# EAGLE design LCD_BiasSupply_Segunda (EAGLE 5.11)

## Sheet 1 of 2
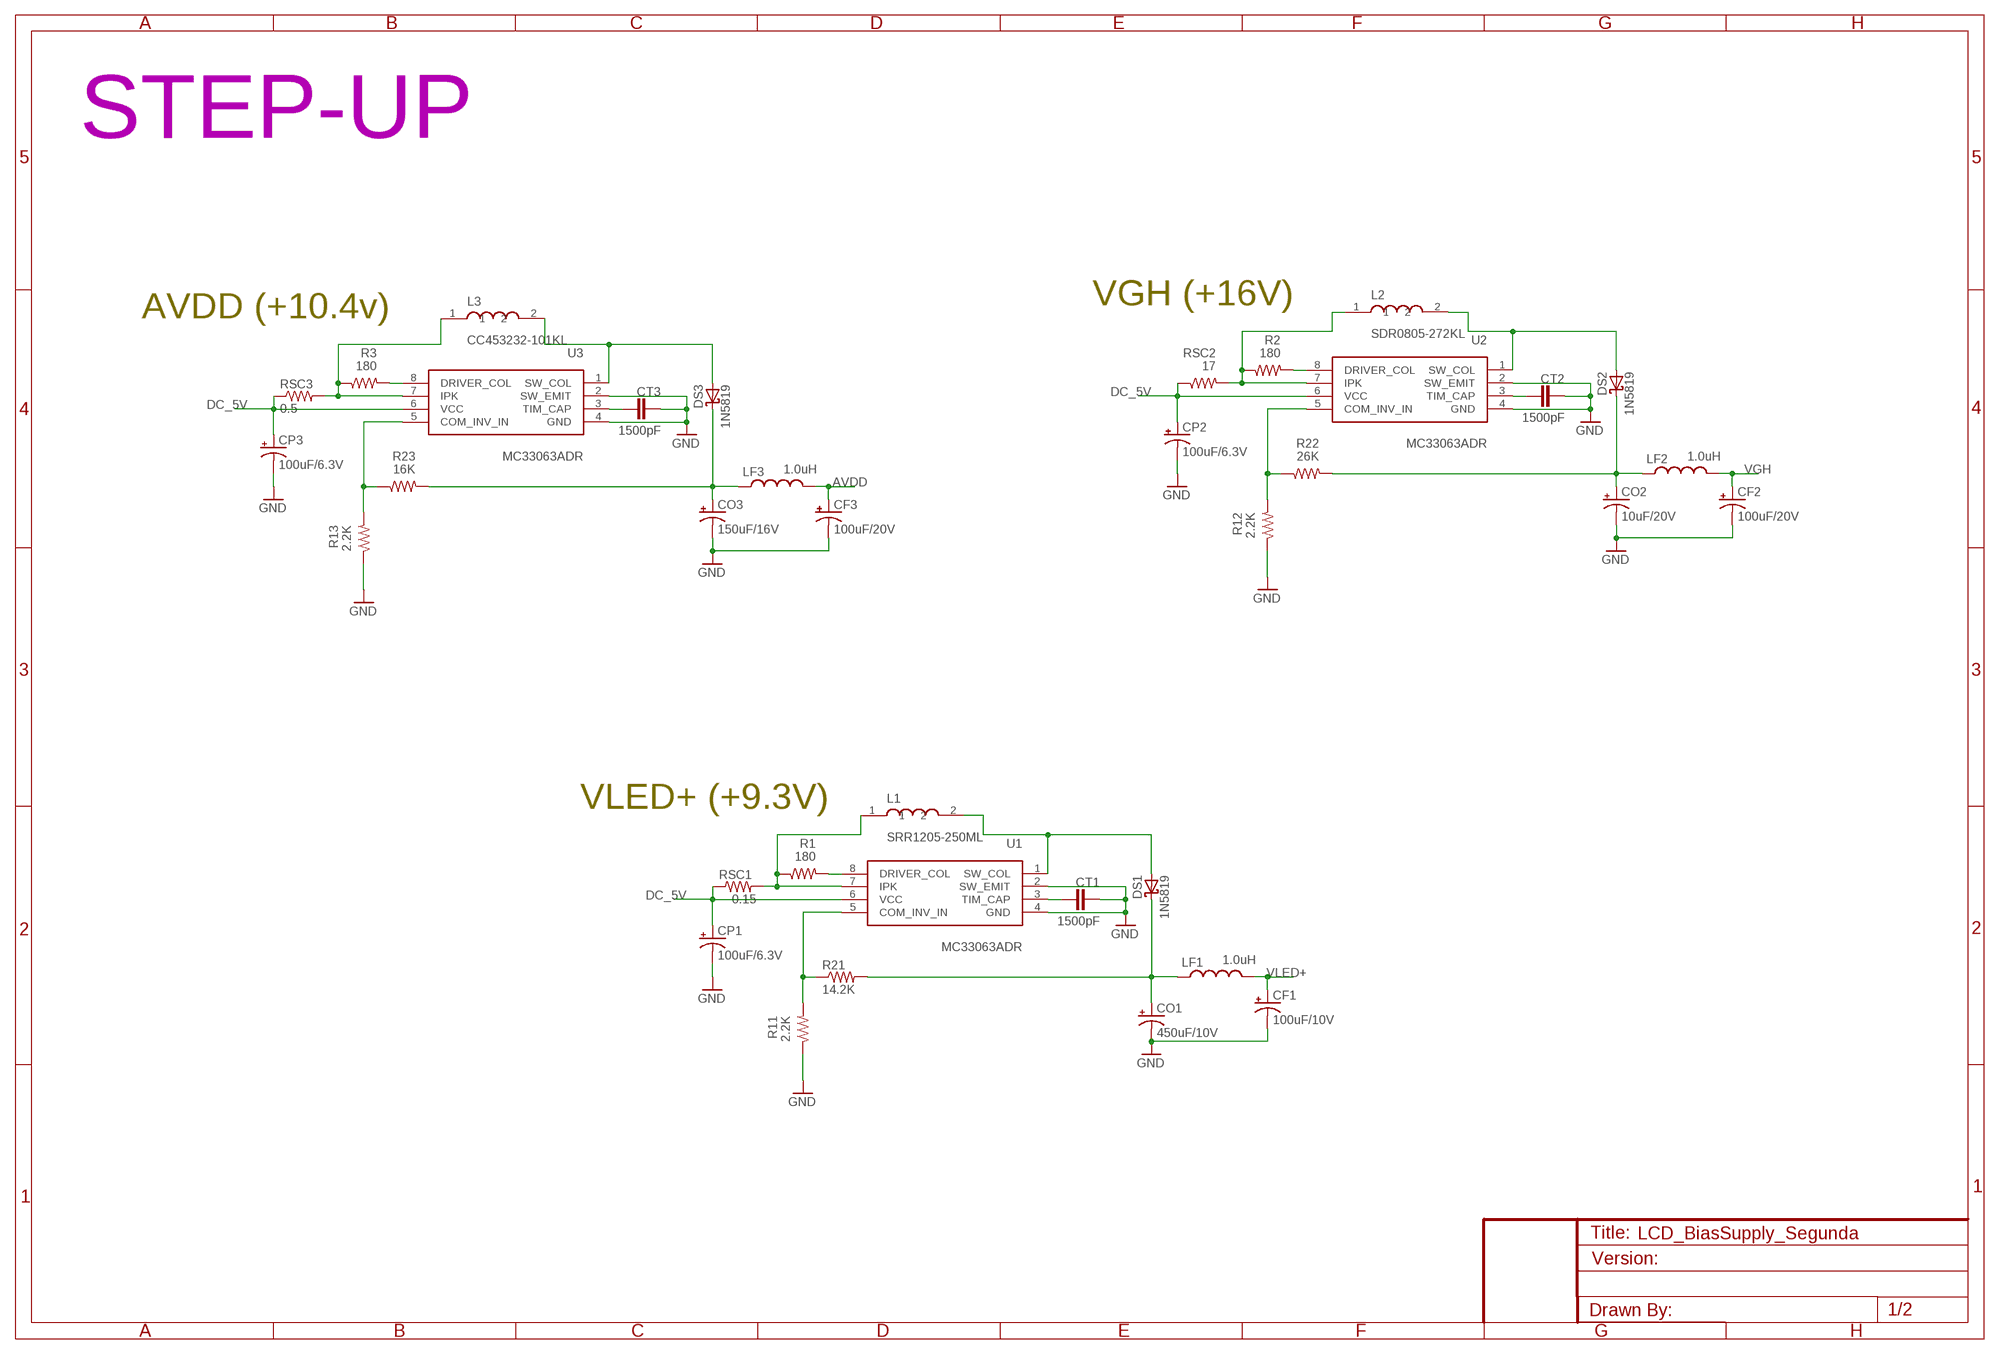
[diagram p0: schematic, sheet 1]

### Parts
CF1  100uF/10V  CAP_POL6032  [EIA6032]
CF2  100uF/20V  CAP_POL7343  [EIA7343]
CF3  100uF/20V  CAP_POL7343  [EIA7343]
CO1  450uF/10V  CAP_POL7343  [EIA7343]
CO2  10uF/20V  CAP_POL3528  [EIA3528]
CO3  150uF/16V  CAP_POL7343  [EIA7343]
CP1  100uF/6.3V  CAP_POL6032  [EIA6032]
CP2  100uF/6.3V  CAP_POL6032  [EIA6032]
CP3  100uF/6.3V  CAP_POL6032  [EIA6032]
CT1  1500pF  CAP0603-CAP  [0603-CAP]
CT2  1500pF  CAP0603-CAP  [0603-CAP]
CT3  1500pF  CAP0603-CAP  [0603-CAP]
DS1  1N5819  SCHOTTKY-DIODE  [SOD123]
DS2  1N5819  SCHOTTKY-DIODE  [SOD123]
DS3  1N5819  SCHOTTKY-DIODE  [SOD123]
L1  SRR1205-250ML  [SRR1205]
L2  SDR0805-272KL  [SDR0805]
L3  CC453232-101KL  [CM453232]
LF1  1.0uH  INDUCTOR0805  [0805]
LF2  1.0uH  INDUCTOR0805  [0805]
LF3  1.0uH  INDUCTOR0805  [0805]
R1  180  RESISTOR0603-RES  [0603-RES]
R2  180  RESISTOR0603-RES  [0603-RES]
R3  180  RESISTOR0603-RES  [0603-RES]
R11  2.2K  RESISTOR0603-RES  [0603-RES]
R12  2.2K  RESISTOR0603-RES  [0603-RES]
R13  2.2K  RESISTOR0603-RES  [0603-RES]
R21  14.2K  RESISTOR0805-RES  [0805]
R22  26K  RESISTOR0603-RES  [0603-RES]
R23  16K  RESISTOR0603-RES  [0603-RES]
RSC1  0.15  RESISTOR1206  [1206]
RSC2  17  RESISTOR0603-RES  [0603-RES]
RSC3  0.5  RESISTOR1206  [1206]
U1  MC33063ADR  [SOIC8]
U2  MC33063ADR  [SOIC8]
U3  MC33063ADR  [SOIC8]

### Nets
AVDD [net_AVDD]: CF3.A(+) LF3.2 ; also sheet 2
DC_5V [net_DC_5V]: CP1.P$1(+) CP2.P$1(+) CP3.P$1(+) RSC1.1 RSC2.1 RSC3.1 U1.6(VCC) U2.6(VCC) U3.6(VCC) ; also sheet 2
GND [net_GND]: CF1.P$2(-) CF2.C(-) CF3.C(-) CO1.C(-) CO2.C(-) CO3.C(-) CP1.P$2(-) CP2.P$2(-) CP3.P$2(-) CT1.2 CT2.2 CT3.2 R11.1 R12.1 R13.1 U1.2(SW_EMIT) U1.4(GND) U2.2(SW_EMIT) U2.4(GND) U3.2(SW_EMIT) U3.4(GND) ; also sheet 2
N$6: DS2.A L2.2 U2.1(SW_COL)
N$7: L2.1 R2.1 RSC2.2 U2.7(IPK)
N$8: R2.2 U2.8(DRIVER_COL)
N$9: R12.2 R22.1 U2.5(COM_INV_IN)
N$10: DS3.A L3.2 U3.1(SW_COL)
N$11: CO2.A(+) DS2.C LF2.1 R22.2
N$12: CT2.1 U2.3(TIM_CAP)
N$13: DS1.A L1.2 U1.1(SW_COL)
N$14: L1.1 R1.1 RSC1.2 U1.7(IPK)
N$15: R1.2 U1.8(DRIVER_COL)
N$16: R11.2 R21.1 U1.5(COM_INV_IN)
N$17: CO1.A(+) DS1.C LF1.1 R21.2
N$18: CT1.1 U1.3(TIM_CAP)
N$23: L3.1 R3.1 RSC3.2 U3.7(IPK)
N$24: R3.2 U3.8(DRIVER_COL)
N$29: R13.2 R23.1 U3.5(COM_INV_IN)
N$31: CO3.A(+) DS3.C LF3.1 R23.2
N$32: CT3.1 U3.3(TIM_CAP)
VGH [net_VGH]: CF2.A(+) LF2.2 ; also sheet 2
VLED+: CF1.P$1(+) LF1.2 ; also sheet 2

### Notes on the sheet
- STEP-UP
- VGH (+16V)
- AVDD (+10.4v)
- VLED+ (+9.3V)

## Sheet 2 of 2
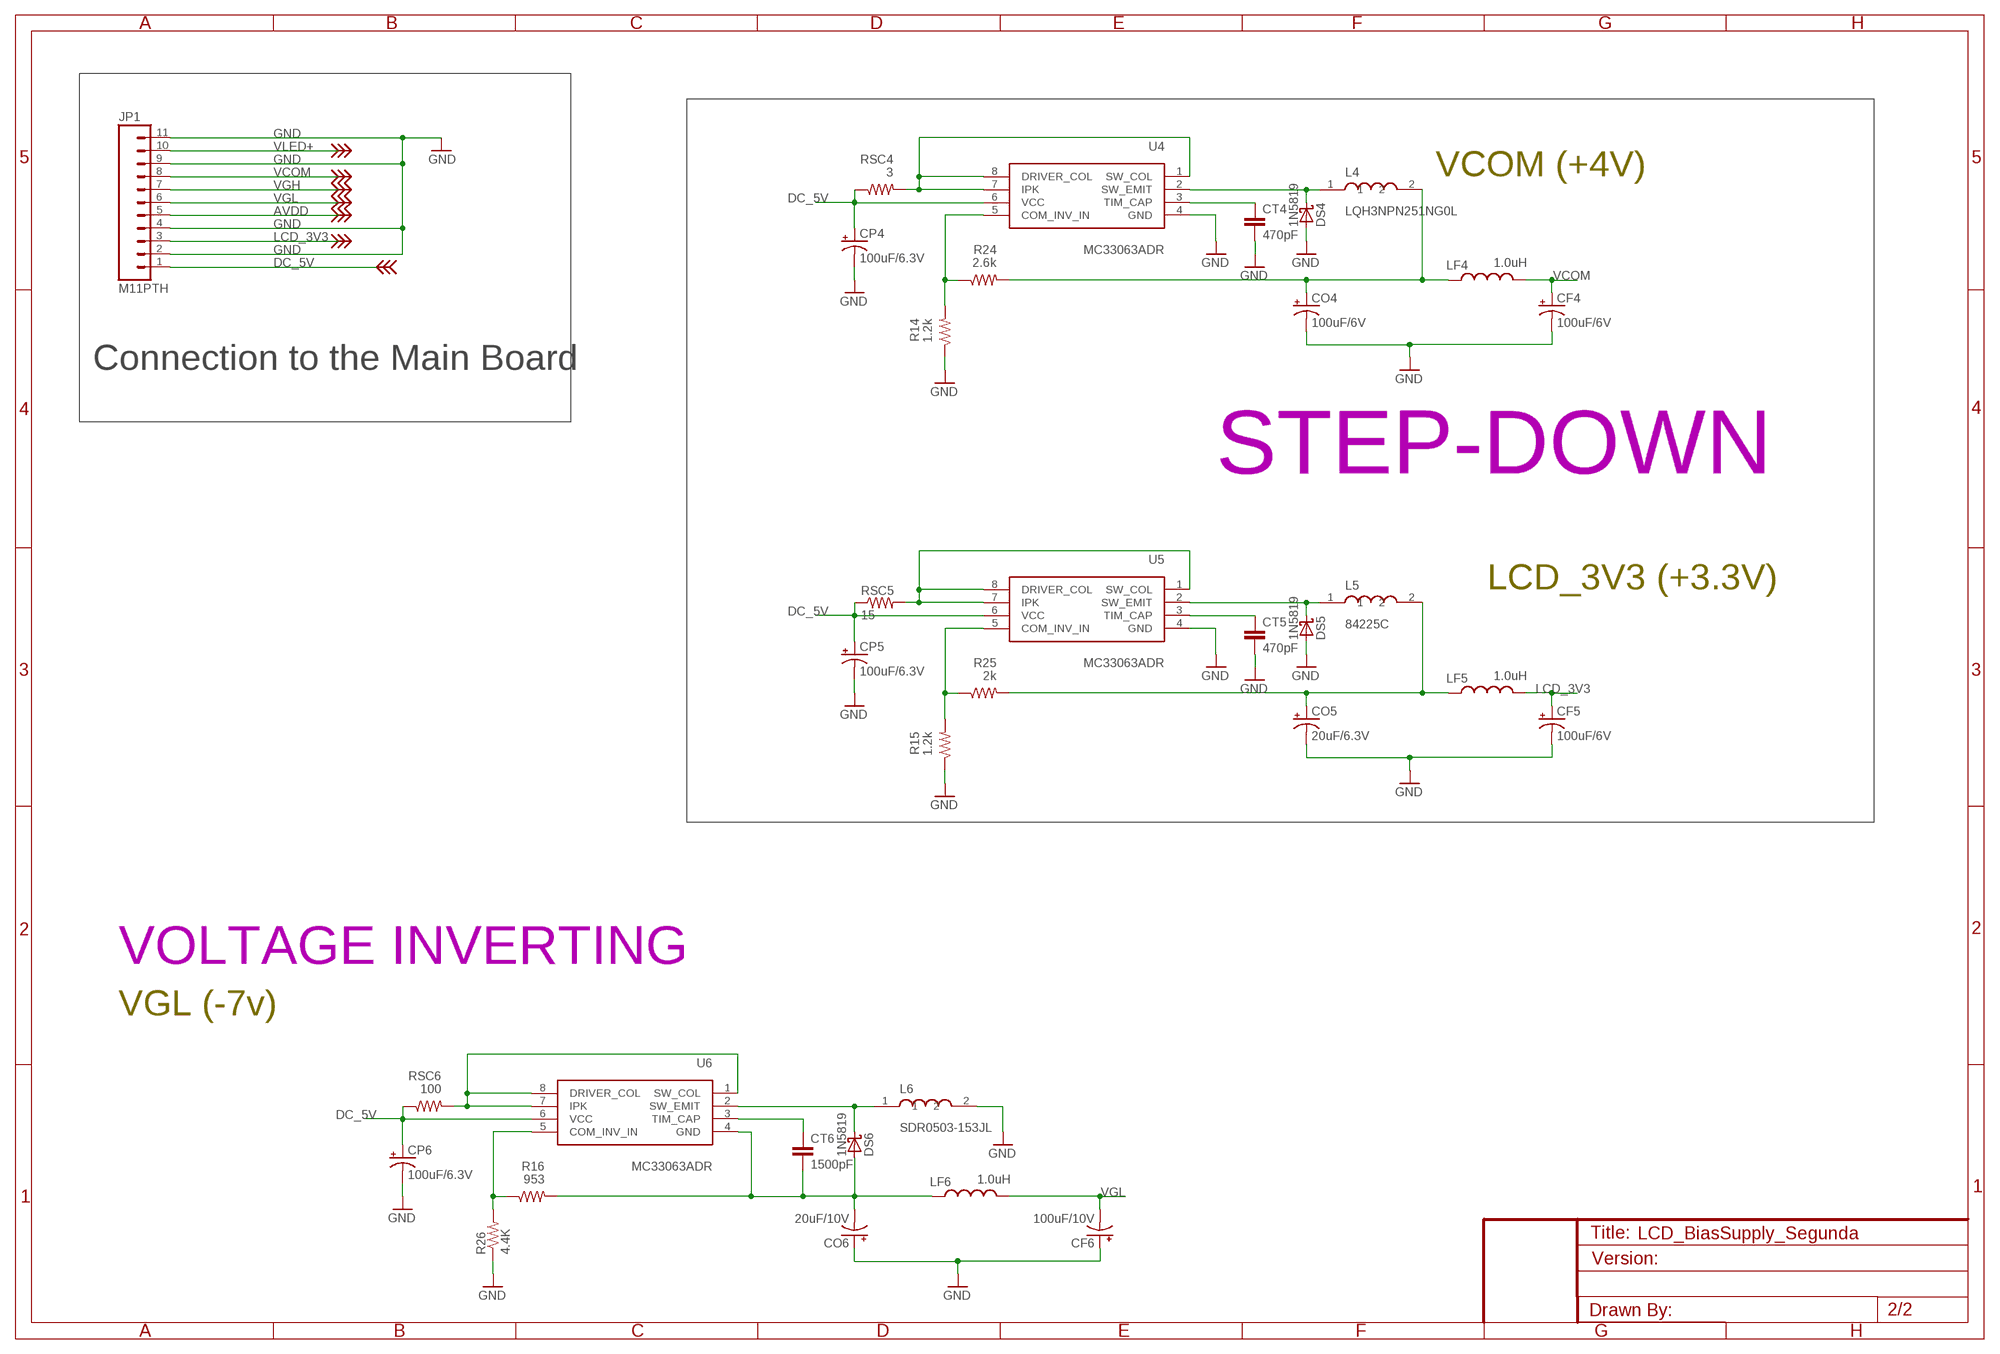
[diagram p1: schematic, sheet 2]

### Parts
CF4  100uF/6V  CAP_POL7343  [EIA7343]
CF5  100uF/6V  CAP_POL7343  [EIA7343]
CF6  100uF/10V  CPOL-USC/6032-28R  [C/6032-28R]
CO4  100uF/6V  CAP_POL7343  [EIA7343]
CO5  20uF/6.3V  CPOL-USA/3216-18W  [A/3216-18W]
CO6  20uF/10V  CPOL-USA/3216-18W  [A/3216-18W]
CP4  100uF/6.3V  CAP_POL6032  [EIA6032]
CP5  100uF/6.3V  CAP_POL6032  [EIA6032]
CP6  100uF/6.3V  CAP_POL6032  [EIA6032]
CT4  470pF  CAP0805  [0805]
CT5  470pF  CAP0805  [0805]
CT6  1500pF  CAP0603-CAP  [0603-CAP]
DS4  1N5819  SCHOTTKY-DIODE  [SOD123]
DS5  1N5819  SCHOTTKY-DIODE  [SOD123]
DS6  1N5819  SCHOTTKY-DIODE  [SOD123]
JP1  M11PTH  [1X11]
L4  LQH3NPN251NG0L  [LQH3NPN251NGOL]
L5  84225C  [84225C]
L6  SDR0503-153JL  [SDR0503]
LF4  1.0uH  INDUCTOR0805  [0805]
LF5  1.0uH  INDUCTOR0805  [0805]
LF6  1.0uH  INDUCTOR0805  [0805]
R14  1.2k  RESISTOR0603-RES  [0603-RES]
R15  1.2k  RESISTOR0603-RES  [0603-RES]
R16  953  RESISTOR0603-RES  [0603-RES]
R24  2.6k  RESISTOR0603-RES  [0603-RES]
R25  2k  RESISTOR0603-RES  [0603-RES]
R26  4.4K  RESISTOR0805-RES  [0805]
RSC4  3  RESISTOR0603-RES  [0603-RES]
RSC5  15  RESISTOR0805-RES  [0805]
RSC6  100  RESISTOR0603-RES  [0603-RES]
U4  MC33063ADR  [SOIC8]
U5  MC33063ADR  [SOIC8]
U6  MC33063ADR  [SOIC8]

### Nets
AVDD [net_AVDD]: JP1.5 ; also sheet 1
DC_5V [net_DC_5V]: CP4.P$1(+) CP5.P$1(+) CP6.P$1(+) JP1.1 RSC4.1 RSC5.1 RSC6.1 U4.6(VCC) U5.6(VCC) U6.6(VCC) ; also sheet 1
GND [net_GND]: CF4.C(-) CF5.C(-) CF6.+ CO4.C(-) CO5.- CO6.+ CP4.P$2(-) CP5.P$2(-) CP6.P$2(-) CT4.2 CT5.2 DS4.A DS5.A JP1.2 JP1.4 JP1.9 JP1.11 L6.2 R14.1 R15.1 R26.1 U4.4(GND) U5.4(GND) ; also sheet 1
LCD_3V3 [net_LCD_3V3]: CF5.A(+) JP1.3 LF5.2
N$1: RSC5.2 U5.1(SW_COL) U5.7(IPK) U5.8(DRIVER_COL)
N$2: R15.2 R25.1 U5.5(COM_INV_IN)
N$3: DS5.C L5.1 U5.2(SW_EMIT)
N$4: CT5.1 U5.3(TIM_CAP)
N$5: CO5.+ L5.2 LF5.1 R25.2
N$19: CO6.- CT6.2 DS6.A LF6.1 R16.2 U6.4(GND)
N$36: DS6.C L6.1 U6.2(SW_EMIT)
N$37: CT6.1 U6.3(TIM_CAP)
N$38: RSC6.2 U6.1(SW_COL) U6.7(IPK) U6.8(DRIVER_COL)
N$39: R16.1 R26.2 U6.5(COM_INV_IN)
N$47: CO4.A(+) L4.2 LF4.1 R24.2
N$53: RSC4.2 U4.1(SW_COL) U4.7(IPK) U4.8(DRIVER_COL)
N$54: R14.2 R24.1 U4.5(COM_INV_IN)
N$55: DS4.C L4.1 U4.2(SW_EMIT)
N$56: CT4.1 U4.3(TIM_CAP)
VCOM [net_VCOM]: CF4.A(+) JP1.8 LF4.2
VGH [net_VGH]: JP1.7 ; also sheet 1
VGL [net_VGL]: CF6.- JP1.6 LF6.2
VLED+: JP1.10 ; also sheet 1

### Notes on the sheet
- VCOM (+4V)
- Connection to the Main Board
- STEP-DOWN
- LCD_3V3 (+3.3V)
- VOLTAGE INVERTING
- VGL (-7v)

## Library data of the parts
CF1-CF5 CO1-CO4 CP1-CP6 = SparkFun:CAP_POL: Capacitor Polarized These are standard SMD and PTH capacitors. Normally 10uF, 47uF, and 100uF in electrolytic and tantalum varieties. Always verify the external diameter of the through hole cap, it varies with capacity, voltage, and manufacturer. The EIA devices should be standard.
CF6 = resistor:CPOL-US: POLARIZED CAPACITOR, American symbol
CO5 CO6 = rcl:CPOL-US: POLARIZED CAPACITOR, American symbol
CT1-CT6 = SparkFun:CAP: Capacitor Standard 0603 ceramic capacitor, and 0.1" leaded capacitor.
DS1-DS6 = inferno_adan:SCHOTTKY-DIODE: Schottky Diode Manufacturer: Diodes Inc. Mouser Part #: 621-1N5819HW-F Manufacturer Part #: 1N5819HW-7-F Product Category: Schottky (Diodes & Rectifiers) RoHS: RoHS Compliant Details Product: Schottky Rectifiers Peak Reverse Voltage: 40 V Forward Continuous Current: 1 A Max Surge Current: 25 A Configuration: Single Forward Voltage Drop: 0.75 V at 3 A Maximum Reverse Leakage Current: 1000 uA Maximum Power Dissipation: 450 mW Operating Temperature Range: - 65 C to + 125 C Mounting Style: SMD/SMT Package / Case: SOD-123
JP1 = SparkFun:M11: Header 11 Standard 11-pin 0.1" header. Use with straight break away headers (SKU : PRT-00116), right angle break away headers (PRT-00553), swiss pins (PRT-00743), machine pins (PRT-00117), and female headers (PRT-00115).
L1 = inferno:SRR1205-250ML: Mouser Part #: 652-SRR1205-250ML Manufacturer Part #: SRR1205-250ML Manufacturer: Bourns Description: Power Inductors 25uH 20%
L2 = inferno:SDR0805-272KL: Mouser Part #: 652-SDR0805-272KL Manufacturer Part #: SDR0805-272KL Manufacturer: Bourns Description: Power Inductors 2.7K 10% SMD
L3 = inferno:CC453232-101KL: Mouser Part #: 652-CC453232-101KL Manufacturer Part #: CC453232-101KL Manufacturer: Bourns Description: Power Inductors 100uH 10% 796KHz
L4 = inferno:LQH3NPN251NG0L: Mouser Part #: 81-LQH3NPN251NG0L Manufacturer Part #: LQH3NPN251NG0L Manufacturer: Murata Description: Power Inductors 1212 250uH 30%
L5 = inferno:84225C: Mouser Part #: 580-84225C Manufacturer Part #: 84225C Manufacturer: Murata Power Solutions Description: Power Inductors 2200uH 0.05A Mini SMT Power
L6 = inferno:SDR0503-153JL: Mouser Part #: 652-SDR0503-153JL Manufacturer Part #: SDR0503-153JL Manufacturer: Bourns Description: Power Inductors 15000uH 5% SMD
LF1-LF6 = SparkFun:INDUCTOR: Inductors Basic Inductor/Choke - 0603 and 1206. Footprints are not proven and vary greatly between part numbers.
R1-R3 R11-R16 R21-R26 RSC1-RSC6 = SparkFun:RESISTOR: Resistor Basic schematic elements and footprints for 0603, 1206, and PTH resistors.
U1-U6 = inferno_adan:MC33063ADR: Manufacturer: Texas Instruments Mouser Part #: 595-MC33063ADR Manufacturer Part #: MC33063ADR Product Category: DC/DC Switching Controllers RoHS: RoHS Compliant Details Number of Outputs: 1 Output Voltage: 1.25 V to 40 V Output Current: 1.5 A Input Voltage: 3 V to 40 V Supply Current: 4 mA Switching Frequency: 100 KHz Mounting Style: SMD/SMT Package / Case: SOIC-8 Maximum Operating Temperature: + 85 C Packaging: Reel Minimum Operating Temperature: - 40 C

## Net classes
0 net_DATA: width 0.178 mm, drill 0.178 mm, clearance 0.178 mm
1 net_DC_5V: width 0.61 mm, drill 0.61 mm, clearance 0.178 mm
2 net_GND: width 0.635 mm, drill 0.508 mm
3 net_VGH: width 0.813 mm, drill 0.813 mm, clearance 0.178 mm
4 net_LCD_3V3: width 0.406 mm, drill 0.406 mm, clearance 0.178 mm
5 net_AVDD: width 0.813 mm, drill 0.813 mm, clearance 0.178 mm
6 net_VGL: width 0.813 mm, drill 0.813 mm, clearance 0.178 mm
7 net_VCOM: width 0.61 mm, drill 0.61 mm, clearance 0.178 mm

## Board
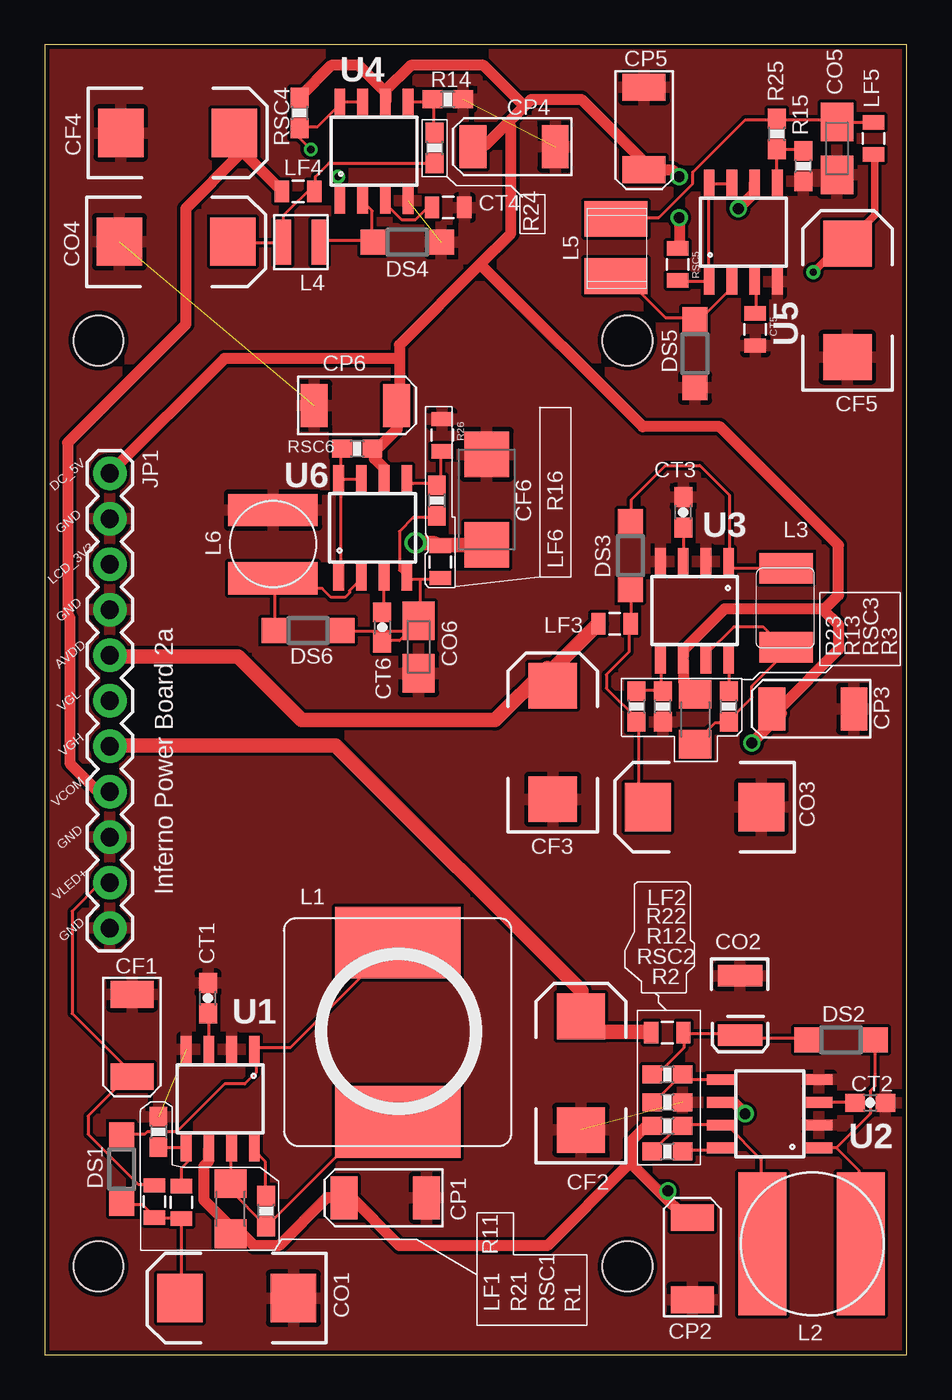
[diagram p2: board, top side]
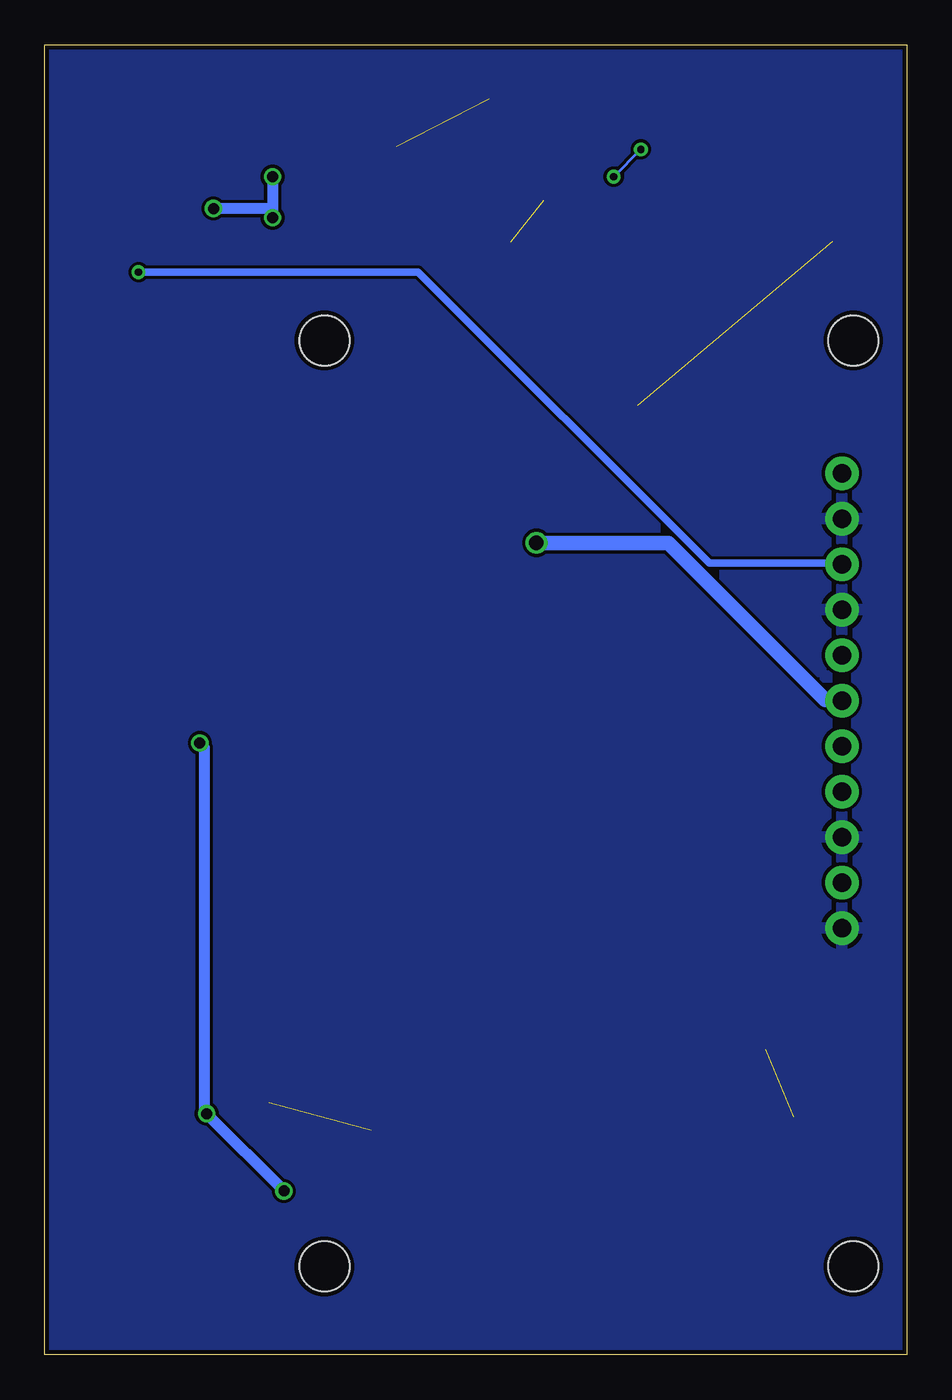
[diagram p3: board, bottom side, seen from below]

Size 48.16 x 73.15 mm. Coordinates in mm from the lower left corner, seen from the top.
Outline: 0,73.15 0,0 48.16,0 48.16,73.15 0,73.15
Copper layers (1*16): Top 0.035mm / dielectric 1.5mm / Bottom 0.035mm
Design rules "alteio_4pcb.com_2010drc": minimum track width 7mil, minimum drill 16mil, track to track 7mil, track to pad 7mil, pad to pad 7mil, via to via 7mil, smd to smd 7mil, copper to edge 10mil, drill to drill 7mil, minimum pad ring 7mil, minimum via ring 7mil, stop-mask expansion 3mil, vias tented up to drill 0mil, thermal gap 10mil
Holes 2.8 mm at 3,56.64 3,4.93 32.54,56.64 32.54,4.93

### Footprints (pad centres in the part's own frame; a part is rotated, then mirrored left to right if it is on the bottom)
EIA6032 = smd 1.5 x 2.4: P$1 -2.3,0; P$2 2.3,0
EIA7343 = smd 2.55 x 2.7: A 3.17,0; C -3.17,0
C/6032-28R = smd 2.55 x 2.5: + 2.525,0; - -2.525,0
EIA3528 = smd 1.2 x 2.5: A 1.65,0; C -1.65,0
A/3216-18W = smd 2.15 x 1.8: + 1.475,0; - -1.475,0
0603-CAP = smd 1.1 x 1: 1 -0.85,0; 2 0.85,0
0805 = smd 0.8 x 1.2: 1 -0.9,0; 2 0.9,0
SOD123 = smd 1.4 x 1.4: A 1.9,0; C -1.9,0
1X11 = drill 1.016 pad 1.88 round: 1 0,0; 2 2.54,0; 3 5.08,0; 4 7.62,0; 5 10.16,0; 6 12.7,0; 7 15.24,0; 8 17.78,0; 9 20.32,0; 10 22.86,0; 11 25.4,0
SRR1205 = smd 4 x 7: 1 -5,0; 2 5,0
SDR0805 = smd 2.7 x 8: 1 -2.8,0; 2 2.7,0
CM453232 = smd 1.7 x 3: 1 -2.2,-0.05; 2 2.2,-0.05
LQH3NPN251NGOL = smd 0.9 x 2.5: 1 -1.05,0; 2 1,0
84225C = smd 2 x 3.5: 1 -1.6,0; 2 1.6,0
SDR0503 = smd 1.8 x 5: 1 -1.9,0; 2 1.9,0
0603-RES = smd 1.1 x 1: 1 -0.85,0; 2 0.85,0
1206 = smd 1.6 x 1.8: 1 -1.4,0; 2 1.4,0
SOIC8 = smd 0.6 x 1.5: 1 -1.905,-2.75; 2 -0.635,-2.75; 3 0.635,-2.75; 4 1.905,-2.75; 5 1.905,2.75; 6 0.635,2.75; 7 -0.635,2.75; 8 -1.905,2.75

### Placement (x,y rotation side)
CF1  4.88,17.83 90 top
CF2  29.95,15.72 90 top
CF3  28.37,34.19 90 top
CF4  7.42,68.22 0 top
CF5  44.83,58.88 90 top
CF6  24.68,47.75 90 top
CO1  10.72,3.16 180 top
CO2  38.84,19.51 270 top
CO3  36.86,30.58 180 top
CO4  7.34,62.15 0 top
CO5  44.25,67.36 90 top
CO6  20.88,39.52 270 top
CP1  19.02,8.76 0 top
CP2  36.17,5.36 270 top
CP3  42.9,36.07 0 top
CP4  26.21,67.46 0 top
CP5  33.48,68.48 90 top
CP6  17.35,53.01 180 top
CT1  9.12,19.91 90 top
CT2  46.1,14.07 0 top
CT3  35.66,47.04 90 top
CT4  22.53,64.06 0 top
CT5  39.67,57.25 270 top
CT6  18.85,40.61 270 top
DS1  4.29,10.36 90 top
DS2  44.48,17.58 0 top
DS3  32.72,44.63 90 top
DS4  20.24,62.13 0 top
DS5  36.32,55.91 270 top
DS6  14.71,40.44 0 top
JP1  3.63,49.23 270 top
L1  19.71,18.01 90 top
L2  42.88,6.2 0 top
L3  41.35,41.71 90 top
L4  14.3,62.13 180 top
L5  31.9,61.82 90 top
L6  12.75,45.26 90 top
LF1  6.12,8.56 90 top
LF2  34.77,17.98 180 top
LF3  31.83,40.82 180 top
LF4  14.15,64.97 180 top
LF5  46.28,67.92 270 top
LF6  22.1,44.27 90 top
R1  12.37,8.03 90 top
R2  34.77,11.35 0 top
R3  38.2,36.2 90 top
R11  6.35,12.45 270 top
R12  34.77,14.1 180 top
R13  34.52,36.2 90 top
R14  22.5,70.1 180 top
R15  42.37,66.37 90 top
R16  21.89,47.7 270 top
R21  7.62,8.51 270 top
R22  34.77,15.65 180 top
R23  33.05,36.2 270 top
R24  21.77,67.39 270 top
R25  40.89,68.17 90 top
R26  22.2,51.35 270 top
RSC1  10.38,8.15 90 top
RSC2  34.77,12.78 0 top
RSC3  36.32,35.48 270 top
RSC4  14.22,69.34 270 top
RSC5  35.34,60.89 270 top
RSC6  17.45,50.6 180 top
U1  9.8,14.3 180 top
U2  40.49,13.46 90 top
U3  36.3,41.55 180 top
U4  18.39,67.21 0 top
U5  39.01,62.69 0 top
U6  18.31,46.18 0 top

### Tracks (layer width: path | path; a pad name or v marks a point on that pad's centre or on a via)
AVDD
  Top 0.813: LF3.2 30.86,40.77 28.45,38.35 28.45,37.47 CF3.A 28.07,38.35 25.15,35.43 14.35,35.43 10.79,38.99 3.68,38.99 JP1.5
DC_5V  (via drill 0.61)
  Top 0.61: 32.77,10.67 32.77,11.94 33.53,12.7 33.91,12.7 RSC2.1 | 34.48,8.95 35.69,7.75 36.07,7.75 CP2.P$1 | 34.48,8.95 32.77,10.67 | v39.12,13.46 38.48,14.1 U2.6 | v34.8,9.14 34.67,9.14 34.48,8.95 | U1.6 9.14,11.43 9.14,10.8 8.89,10.54 8.89,8.64 10.29,7.24 10.29,6.86 RSC1.1 10.54,7.24 11.68,6.1 13.08,6.1 15.75,8.76 CP1.P$1 17.02,8.89 19.81,6.1 28.07,6.1 32.51,10.54 32.77,10.67 | RSC3.1 36.32,36.96 35.69,37.59 35.69,38.73 U3.6 35.69,39.12 35.69,39.37 37.97,41.66 43.43,41.66 43.5,41.59 | 43.5,41.59 44.32,40.77 44.32,39.37 41.02,36.07 CP3.P$1 41.15,35.81 v39.5,34.16 | U6.6 18.92,49.02 18.92,49.53 18.41,50.04 18.41,50.55 RSC6.1 18.67,50.67 19.68,51.69 19.68,52.96 CP6.P$1 19.81,53.21 19.81,55.63 | 18.99,70.55 19.05,70.48 19.05,69.98 U4.6 | 18.99,70.55 17.53,72.01 16,72.01 14.22,70.23 RSC4.1 | v35.43,63.5 35.43,61.85 RSC5.1 | v35.43,65.79 35.05,66.17 33.53,66.17 CP5.P$1 33.66,66.42 29.97,70.1 27.18,70.1 26.8,69.72 | v38.73,64.01 39.62,64.9 39.62,65.41 U5.6 | 25.84,68.77 26.8,69.72 | 25.84,68.77 24.64,67.56 24,67.56 CP4.P$1 | 18.99,70.55 20.45,72.01 24.51,72.01 26.8,69.72 | 19.81,55.63 19.81,56.39 24.32,60.9 | 24.32,60.9 26.04,62.61 26.04,68.58 25.84,68.77 | JP1.1 10.03,55.63 19.81,55.63 | 43.5,41.59 44.32,42.42 44.32,45.21 37.72,51.82 33.4,51.82 24.32,60.9
  Bottom 0.61: v34.8,9.14 v39.12,13.46 39.24,13.72 39.24,33.91 v39.5,34.16 | v35.43,65.79 35.43,64.01 | 35.43,64.01 v35.43,63.5 | 35.43,64.01 v38.73,64.01
GND  (5 unrouted)
  pour Top: 0,73.15 48.16,73.15 48.16,0 0,0
  pour Bottom: 0,73.15 48.16,73.15 48.16,0 0,0
LCD_3V3  (via drill 0.41)
  Top 0.406: LF5.2 46.35,66.93 46.35,63.63 44.83,62.1 CF5.A 44.7,62.23 v42.93,60.45
  Bottom 0.406: v42.93,60.45 27.3,60.45 11.05,44.2 3.68,44.2 JP1.3
N$1
  Top 0.178: U5.7 38.35,65.41 37.21,65.41 U5.8 37.08,65.41 37.08,59.94 | 37.08,59.94 35.43,59.94 RSC5.2 | 37.08,59.94 U5.1
N$2
  Top 0.178: 40.89,67.31 42.29,67.31 R15.2 | 40.89,67.31 40.89,65.53 U5.5 | 40.89,67.31 R25.1
N$3
  Top 0.178: 36.32,57.91 36.7,57.91 38.35,59.56 38.35,59.82 U5.2 | 36.32,57.91 34.67,57.91 32.38,60.2 32,60.2 L5.1 | 36.32,57.91 DS5.C
N$4
  Top 0.178: CT5.1 39.75,58.17 39.75,59.82 U5.3
N$5
  Top 0.178: 40.89,68.96 44.2,68.96 CO5.+ 44.32,68.83 46.23,68.83 LF5.1 | 40.89,68.96 39.12,68.96 36.2,66.04 36.2,65.41 34.29,63.5 32,63.5 L5.2 | 40.89,68.96 R25.2
N$6
  Top 0.178: 44.2,11.56 46.1,13.46 46.1,14.73 46.35,14.99 46.35,17.53 DS2.A | 44.2,11.56 U2.1 | 44.2,11.56 45.47,10.29 45.47,6.22 L2.2
N$7
  Top 0.178: R2.1 34.04,11.43 35.31,12.7 35.56,12.7 RSC2.2 35.69,12.83 U2.7 38.1,12.83 40.01,10.92 40.01,6.22 L2.1
N$8
  Top 0.178: R2.2 35.69,11.43 37.59,11.43 37.72,11.56 U2.8
N$9
  Top 0.178: 35.31,15.37 35.56,15.62 R22.1 35.31,15.37 | 35.31,15.37 34.04,14.1 R12.2 | 35.31,15.37 U2.5
N$10
  Top 0.178: DS3.A 32.77,46.61 32.77,47.75 34.67,49.66 36.58,49.66 38.23,48.01 38.23,44.32 U3.1 38.23,44.2 38.48,43.94 41.27,43.94 L3.2
N$11
  Top 0.178: 35.69,17.91 35.69,17.15 34.29,15.75 34.04,15.75 R22.2 | DS2.C 42.55,17.65 38.99,17.65 38.86,17.78 CO2.A 38.73,17.91 35.69,17.91 | 35.69,17.91 LF2.1
N$12
  Top 0.178: CT2.1 45.21,14.1 U2.3
N$13
  Top 0.178: DS1.A 4.32,12.32 5.59,12.32 5.71,12.45 7.37,12.45 10.03,15.11 11.18,15.11 11.81,15.75 11.81,17.02 U1.1 11.81,17.15 13.72,17.15 19.68,23.11 L1.2
N$14
  Top 0.178: U1.7 10.41,11.43 10.41,9.65 RSC1.2 10.41,9.52 10.41,9.14 12.32,7.24 R1.1 12.45,7.24 18.16,12.95 19.68,12.95 L1.1
N$15
  Top 0.178: R1.2 12.32,8.89 12.32,10.8 11.68,11.43 U1.8
N$16
  Top 0.178: R11.2 6.35,11.56 7.87,11.56 U1.5 8,11.43 8,10.8 7.62,10.41 7.62,9.52 R21.1
N$17
  Top 0.178: DS1.C 4.32,8.38 5.46,8.38 6.1,7.75 LF1.1 6.22,7.62 7.49,7.62 R21.2 7.62,7.49 7.62,3.17 CO1.A
N$18
  Top 0.178: CT1.1 9.14,19.05 9.14,17.15 U1.3
N$19
  Top 0.178: R16.2 21.84,46.74 20.57,46.74 19.81,45.97 19.81,43.81 20.19,43.43 U6.4 20.32,43.31 20.95,43.31 | 20.95,43.31 22.1,43.31 LF6.1 | 20.32,40.39 20.83,40.89 CO6.- | 20.32,40.39 19.81,39.88 18.92,39.88 CT6.2 | 20.32,40.39 16.64,40.39 DS6.A | CO6.- 20.32,40.39 | 20.95,43.31 20.95,41.02 CO6.-
N$23
  Top 0.178: RSC3.2 36.32,34.16 37.47,35.31 38.1,35.31 R3.1 38.23,35.43 39.5,36.7 39.5,37.34 41.27,39.12 41.27,39.5 | 41.27,39.5 40.13,40.64 38.48,40.64 36.96,39.12 36.96,38.86 U3.7 | 41.27,39.5 L3.1
N$24
  Top 0.178: R3.2 38.23,37.08 38.23,38.73 U3.8
N$29
  Top 0.178: 34.42,37.08 33.15,37.08 R23.1 | 34.42,37.08 34.42,38.73 U3.5 | 34.42,37.08 R13.2
N$31
  Top 0.178: DS3.C 32.77,42.67 32.77,40.89 LF3.1 32.64,40.77 32.64,39.24 31.37,37.97 31.37,37.21 33.15,35.43 R23.2 33.15,35.31 33.15,31.12 33.66,30.61 CO3.A
N$32
  Top 0.178: CT3.1 35.69,46.1 35.69,44.32 U3.3
N$36
  Top 0.178: 12.83,42.8 12.83,43.31 L6.1 12.83,42.8 | 12.83,42.8 12.83,40.51 DS6.C | 12.83,42.8 15.49,42.8 16,42.29 16.76,42.29 17.02,42.55 17.02,42.67 17.65,43.31 U6.2
N$37
  Top 0.178: CT6.1 18.92,41.53 18.92,43.31 U6.3
N$38
  Top 0.178: RSC6.2 16.51,50.55 16.51,49.02 U6.8 16.51,48.89 | 16.51,48.89 16.51,43.43 U6.1 | 16.51,48.89 17.65,48.89 U6.7
N$39
  Top 0.178: U6.5 20.32,48.89 20.57,48.64 21.84,48.64 R16.1 21.97,48.64 22.1,48.77 22.1,50.42 R26.2
N$47
  Top 0.178: CO4.A 10.54,62.1 13.21,62.1 L4.2 13.34,62.23 13.34,63.63 15.11,65.41 | 15.11,65.41 15.11,65.02 LF4.1 15.11,65.41 | 15.11,65.41 15.11,65.79 15.88,66.55 21.72,66.55 R24.2
N$53  (via drill 0.41)
  Top 0.178: v16.38,65.79 16.38,64.52 U4.1 | v14.86,67.31 14.22,67.95 RSC4.2 14.22,68.58 15.24,68.58 16.51,69.85 U4.8 16.51,69.98 17.65,69.98 U4.7
  Bottom 0.178: v16.38,65.79 v14.86,67.31
N$54
  Top 0.178: 21.72,69.98 21.72,68.33 R24.1 | 21.72,69.98 21.72,70.1 R14.2 21.72,69.98 | 21.72,69.98 20.32,69.98 U4.5
N$55
  Top 0.178: 18.29,62.23 18.29,63.88 17.78,64.39 U4.2 | 18.29,62.23 15.37,62.23 L4.1 | 18.29,62.23 DS4.C
N$56
  Top 0.178: CT4.1 21.59,64.01 21.34,64.01 20.7,63.37 19.94,63.37 18.92,64.39 U4.3
VCOM
  Top 0.61: LF4.2 13.21,65.02 10.67,67.56 10.67,68.2 CF4.A 10.92,67.06 7.87,64.01 7.87,57.53 1.27,50.93 1.27,41.28 1.4,41.15 1.4,33.02 2.92,31.5 3.56,31.5 JP1.8
VGH
  Top 0.813: LF2.2 33.78,18.03 30.73,18.03 29.97,18.8 CF2.A 29.97,19.3 29.97,20.32 16.26,34.04 3.68,34.04 JP1.7
VGL  (via drill 0.81)
  Top 0.813: CF6.- 24.64,45.21 22.1,45.21 LF6.2 21.72,45.34 v20.7,45.34
  Bottom 0.813: v20.7,45.34 13.34,45.34 4.57,36.58 3.68,36.58 JP1.6
VLED+
  Top 0.178: LF1.2 6.1,9.52 5.21,9.52 2.41,12.32 2.41,13.34 4.57,15.49 4.83,15.49 CF1.P$1 4.95,15.62 1.52,19.05 1.52,24.77 3.05,26.29 3.56,26.29 JP1.10

### Text on the board
tNames: DC_5V | GND | LCD_3V3 | GND | AVDD | VGL | VGH | VCOM | GND | Inferno Power Board 2a | VLED+ | GND